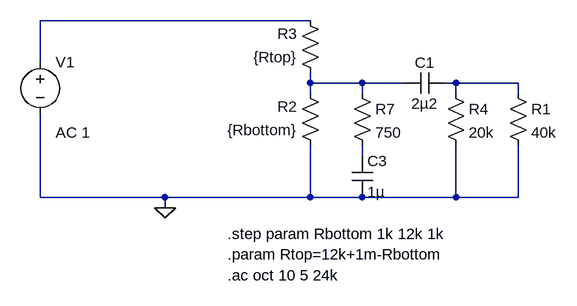
[diagram p0: schematic loudness_control_2.asc]
loudness_control_2.asc, the LTspice schematic file:
Version 4
SHEET 1 1400 680
WIRE 480 48 64 48
WIRE 64 112 64 48
WIRE 480 144 480 128
WIRE 560 144 480 144
WIRE 624 144 560 144
WIRE 704 144 688 144
WIRE 800 144 704 144
WIRE 480 160 480 144
WIRE 560 160 560 144
WIRE 704 160 704 144
WIRE 800 160 800 144
WIRE 560 256 560 240
WIRE 64 320 64 192
WIRE 256 320 64 320
WIRE 480 320 480 240
WIRE 480 320 256 320
WIRE 560 320 480 320
WIRE 704 320 704 240
WIRE 704 320 560 320
WIRE 800 320 800 240
WIRE 800 320 704 320
WIRE 256 336 256 320
FLAG 256 336 0
SYMBOL voltage 64 96 R0
WINDOW 123 24 124 Left 2
WINDOW 39 0 0 Left 0
SYMATTR Value2 AC 1
SYMATTR InstName V1
SYMATTR Value ""
SYMBOL res 496 256 R180
WINDOW 0 36 76 Left 2
WINDOW 3 36 40 Left 2
SYMATTR InstName R2
SYMATTR Value {Rbottom}
SYMBOL res 496 144 R180
WINDOW 0 36 76 Left 2
WINDOW 3 36 40 Left 2
SYMATTR InstName R3
SYMATTR Value {Rtop}
SYMBOL cap 544 256 R0
SYMATTR InstName C3
SYMATTR Value 1µ
SYMBOL res 784 144 R0
SYMATTR InstName R1
SYMATTR Value 40k
SYMBOL res 544 144 R0
SYMATTR InstName R7
SYMATTR Value 750
SYMBOL cap 688 128 R90
WINDOW 0 0 32 VBottom 2
WINDOW 3 32 32 VTop 2
SYMATTR InstName C1
SYMATTR Value 2µ2
SYMBOL res 688 144 R0
SYMATTR InstName R4
SYMATTR Value 20k
TEXT 352 376 Left 2 !.step param Rbottom 1k 12k 1k
TEXT 352 440 Left 2 !.ac oct 10 5 24k
TEXT 352 408 Left 2 !.param Rtop=12k+1m-Rbottom

The netlist it stands for:
* loudness_control_2.asc
V1 N001 0 AC 1
R2 0 N002 {Rbottom}
R3 N002 N001 {Rtop}
C3 N004 0 1µ
R1 N003 0 40k
R7 N002 N004 750
C1 N003 N002 2µ2
R4 N003 0 20k
.step param Rbottom 1k 12k 1k
.ac oct 10 5 24k
.param Rtop=12k+1m-Rbottom
.backanno
.end